# EasyEDA Pro project midi_footswitch.eprj

# Schematic midi
Board Name: midi; Create Date: 2025-01-20; Page Name: Sheet_1; Project Name: midi_footswitch; Schematic Name: midi; Update Date: 2025-01-20; Company: EasyEDA.com; Page Size: A4; Version: V1.0
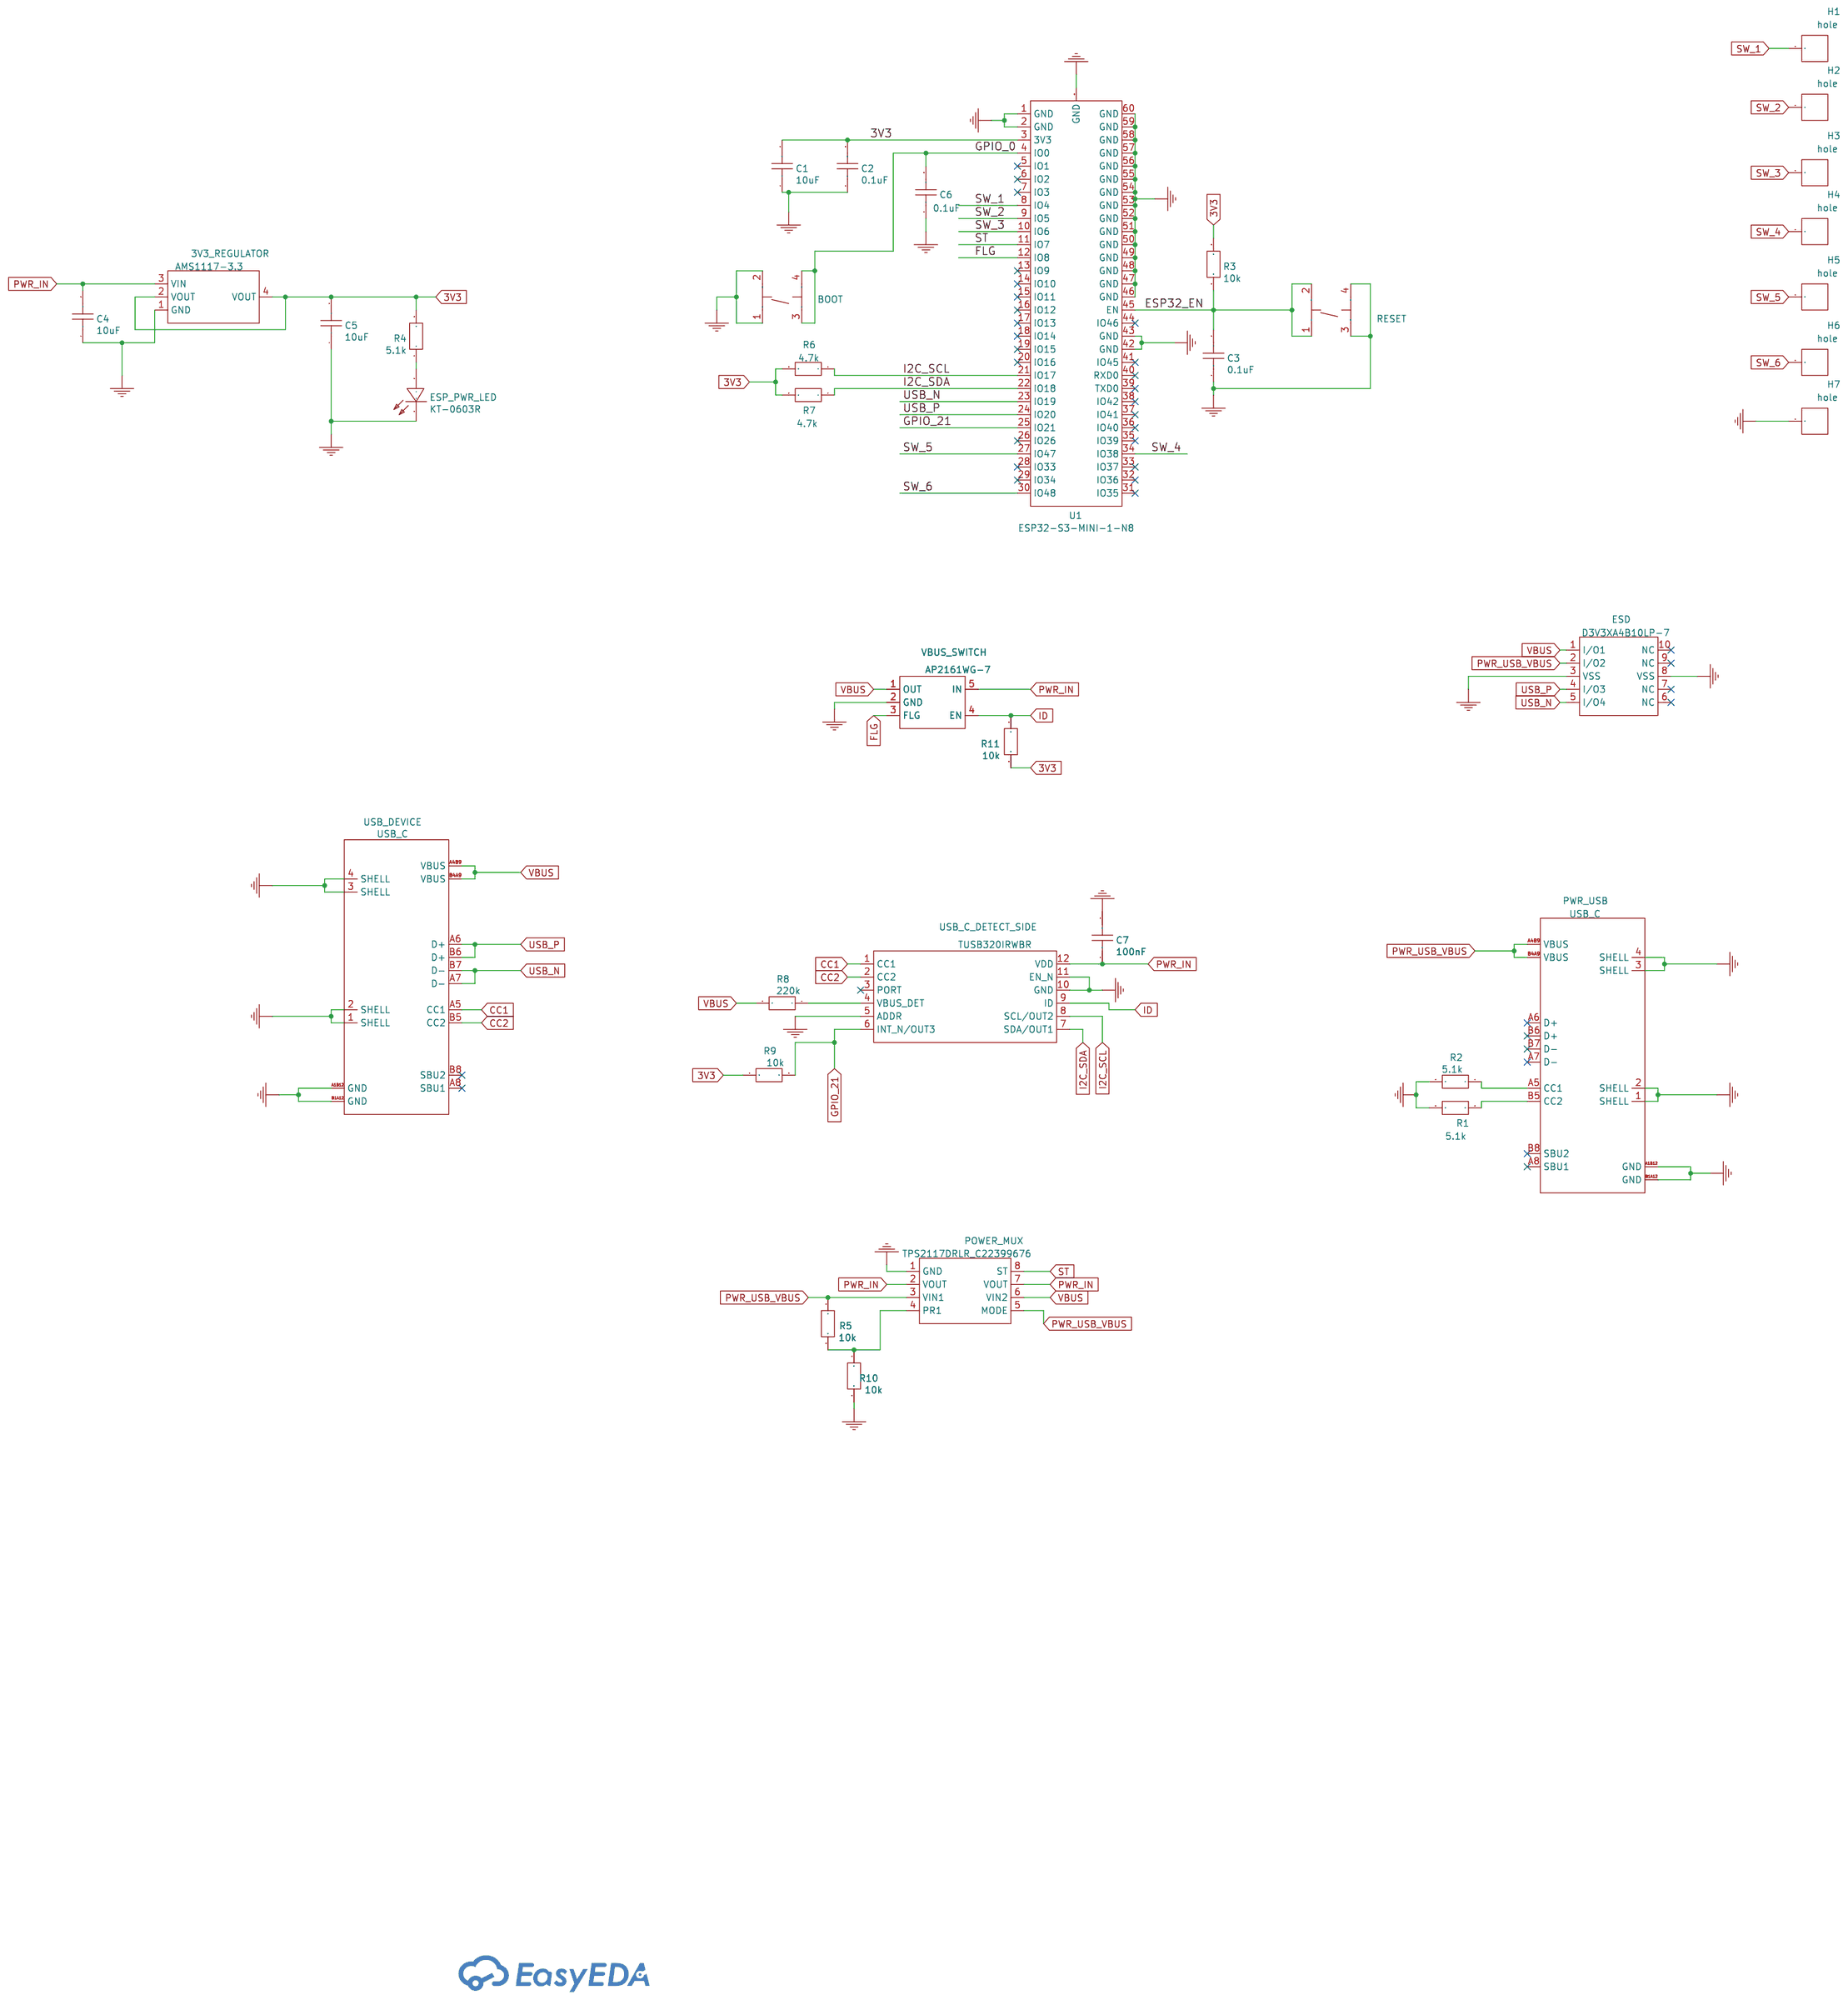
[diagram p0: schematic sheet]

## Parts
3V3_REGULATOR  AMS1117-3.3  [SOT-223-3_L6.5-W3.4-P2.30-LS7.0-BR]
BOOT  TS-1187A-B-A-B  [SW-SMD_4P-L5.1-W5.1-P3.70-LS6.5-TL_H1.5]
C1  10uF  [C0603]
C2  0.1uF  [C0603]
C3  0.1uF  [C0603]
C4  10uF  [C0603]
C5  10uF  [C0603]
C6  0.1uF  [C0603]
C7  100nF  [C0603]
ESD  D3V3XA4B10LP-7  [U-DFN2510-10_L2.5-W1.0-P0.50-BL]
ESP_PWR_LED  KT-0603R  [LED0603-RD]
H1  hole  [HOLE_FOOTPRITNG]
H2  hole  [HOLE_FOOTPRITNG]
H3  hole  [HOLE_FOOTPRITNG]
H4  hole  [HOLE_FOOTPRITNG]
H5  hole  [HOLE_FOOTPRITNG]
H6  hole  [HOLE_FOOTPRITNG]
H7  hole  [HOLE_FOOTPRITNG]
POWER_MUX  TPS2117DRLR_C22399676  [SOT-583-8_L2.1-W1.2-P0.50-LS1.6-BL]
PWR_USB  USB_C  [USB-C-SMD_G-SWITCH_GT-USB-7010EN]
R1  5.1k  [R0603]
R2  5.1k  [R0603]
R3  10k  [R0603]
R4  5.1k  [R0603]
R5  10k  [R0603]
R6  4.7k  [R0603]
R7  4.7k  [R0603]
R8  220k  [R0603]
R9  10k  [R0603]
R10  10k  [R0603]
R11  10k  [R0603]
RESET  TS-1187A-B-A-B  [SW-SMD_4P-L5.1-W5.1-P3.70-LS6.5-TL_H1.5]
U1  ESP32-S3-MINI-1-N8  [BULETM-SMD_ESP32-S3-MINI-1-N8]
USB_C_DETECT_SIDE  TUSB320IRWBR  [X2QFN-12_L1.6-W1.6-P0.40-TL]
USB_DEVICE  USB_C  [USB-C-SMD_G-SWITCH_GT-USB-7010EN]
VBUS_SWITCH  AP2161WG-7  [SOT-23-5_L2.9-W1.6-P0.95-LS2.8-BL]

## Library data of the parts
3V3_REGULATOR = AMS1117-3.3: Supplier: LCSC; Manufacturer: AMS; Supplier Part: C6186; JLCPCB Part Class: Basic Part
BOOT RESET = TS-1187A-B-A-B: Supplier: LCSC; Supplier Part: C318884; Manufacturer: XKB Connectivity(中国星坤); JLCPCB Part Class: Basic Part
C1 C4 C5 = 10uF
C2 C3 C6 = 0.1uF
C7 = 100nF
ESD = D3V3XA4B10LP-7: Supplier: LCSC; Supplier Part: C1980462; Manufacturer: DIODES(美台); JLCPCB Part Class: Extended Part
ESP_PWR_LED = KT-0603R: Supplier: LCSC; Manufacturer: KENTO; Supplier Part: C2286; JLCPCB Part Class: Basic Part; link: https://lcsc.com/eda_search?q=C2286&%26type=1&ref=editor
H1-H7 = hole
POWER_MUX = TPS2117DRLR_C22399676: Supplier: LCSC; Supplier Part: C22399676; Manufacturer: TI(德州仪器); Manufacturer Part: TPS2117DRLR; JLCPCB Part Class: Extended Part
PWR_USB USB_DEVICE = USB_C: Supplier: LCSC; Supplier Part: C2997433; Manufacturer: HCTL(华灿天禄); Manufacturer Part: HC-TYPE-C-16P-01A-R; JLCPCB Part Class: Extended Part
R1 R2 R4 = 5.1k
R3 R5 R9-R11 = 10k
R6 R7 = 4.7k
R8 = 220k
U1 = ESP32-S3-MINI-1-N8: Supplier: LCSC; Supplier Part: C2913206; Manufacturer: ESPRESSIF(乐鑫); JLCPCB Part Class: Extended Part
USB_C_DETECT_SIDE = TUSB320IRWBR: Supplier: LCSC; Supplier Part: C80170; Manufacturer: TI(德州仪器); JLCPCB Part Class: Extended Part
VBUS_SWITCH = AP2161WG-7: Supplier: LCSC; Supplier Part: C176957; Manufacturer: DIODES(美台); JLCPCB Part Class: Extended Part

## Nets
3V3: 3V3_REGULATOR.2(VOUT) 3V3_REGULATOR.4(VOUT) C1.2 C2.2 C5.2 R3.2 R4.2 R6.2 R7.2 R9.1 R11.2 U1.3(3V3)
GND: 3V3_REGULATOR.1(GND) BOOT.1(A) BOOT.2(B) C1.1 C2.1 C3.1 C4.1 C5.1 C6.1 C7.2 ESD.3(VSS) ESD.8(VSS) ESP_PWR_LED.1(K) H7.1 POWER_MUX.1(GND) PWR_USB.1(SHELL) PWR_USB.2(SHELL) PWR_USB.3(SHELL) PWR_USB.4(SHELL) PWR_USB.A1B12(GND) PWR_USB.B1A12(GND) R1.2 R2.2 R10.2 RESET.3(C) RESET.4(D) U1.1(GND) U1.2(GND) U1.42(GND) U1.43(GND) U1.46(GND) U1.47(GND) U1.48(GND) U1.49(GND) U1.50(GND) U1.51(GND) U1.52(GND) U1.53(GND) U1.54(GND) U1.55(GND) U1.56(GND) U1.57(GND) U1.58(GND) U1.59(GND) U1.60(GND) U1.GND USB_C_DETECT_SIDE.5(ADDR) USB_C_DETECT_SIDE.10(GND) USB_C_DETECT_SIDE.11(EN_N) USB_DEVICE.1(SHELL) USB_DEVICE.2(SHELL) USB_DEVICE.3(SHELL) USB_DEVICE.4(SHELL) USB_DEVICE.A1B12(GND) USB_DEVICE.B1A12(GND) VBUS_SWITCH.2(GND)
VBUS: ESD.1(I/O1) POWER_MUX.6(VIN2) R8.2 USB_DEVICE.A4B9(VBUS) USB_DEVICE.B4A9(VBUS) VBUS_SWITCH.1(OUT)
CC1: USB_C_DETECT_SIDE.1(CC1) USB_DEVICE.A5(CC1)
CC2: USB_C_DETECT_SIDE.2(CC2) USB_DEVICE.B5(CC2)
ESP32_EN: C3.2 R3.1 RESET.1(A) RESET.2(B) U1.45(EN)
FLG: U1.12(IO8) VBUS_SWITCH.3(FLG)
GPIO_0: BOOT.3(C) BOOT.4(D) C6.2 U1.4(IO0)
GPIO_21: R9.2 U1.25(IO21) USB_C_DETECT_SIDE.6(INT_N/OUT3)
I2C_SCL: R6.1 U1.21(IO17) USB_C_DETECT_SIDE.8(SCL/OUT2)
I2C_SDA: R7.1 U1.22(IO18) USB_C_DETECT_SIDE.7(SDA/OUT1)
ID: R11.1 USB_C_DETECT_SIDE.9(ID) VBUS_SWITCH.4(EN)
PWR_IN: 3V3_REGULATOR.3(VIN) C4.2 C7.1 POWER_MUX.2(VOUT) POWER_MUX.7(VOUT) USB_C_DETECT_SIDE.12(VDD) VBUS_SWITCH.5(IN)
PWR_USB_VBUS: ESD.2(I/O2) POWER_MUX.3(VIN1) POWER_MUX.5(MODE) PWR_USB.A4B9(VBUS) PWR_USB.B4A9(VBUS) R5.1
ST: POWER_MUX.8(ST) U1.11(IO7)
SW_1: H1.1 U1.8(IO4)
SW_2: H2.1 U1.9(IO5)
SW_3: H3.1 U1.10(IO6)
SW_4: H4.1 U1.34(IO38)
SW_5: H5.1 U1.27(IO47)
SW_6: H6.1 U1.30(IO48)
USB_N: ESD.5(I/O4) U1.23(IO19) USB_DEVICE.A7(D-) USB_DEVICE.B7(D-)
USB_P: ESD.4(I/O3) U1.24(IO20) USB_DEVICE.A6(D+) USB_DEVICE.B6(D+)
POWER_MUX_4: POWER_MUX.4(PR1) R5.2 R10.1
PWR_USB_A5: PWR_USB.A5(CC1) R2.1
PWR_USB_B5: PWR_USB.B5(CC2) R1.1
R4_1: ESP_PWR_LED.2(A) R4.1
USB_C_DETECT_SIDE_4: R8.1 USB_C_DETECT_SIDE.4(VBUS_DET)

Not connected (* = marked no-connect by the designer): ESD 6(NC)* 7(NC)* 9(NC)* 10(NC)*; PWR_USB A6(D+)* A7(D-)* A8(SBU1)* B6(D+)* B7(D-)* B8(SBU2)*; U1 5(IO1)* 6(IO2)* 7(IO3)* 13(IO9)* 14(IO10)* 15(IO11)* 16(IO12)* 17(IO13)* 18(IO14)* 19(IO15)* 20(IO16)* 26(IO26)* 28(IO33)* 29(IO34)* 31(IO35)* 32(IO36)* 33(IO37)* 35(IO39)* 36(IO40)* 37(IO41)* 38(IO42)* 39(TXD0)* 40(RXD0)* 41(IO45)* 44(IO46)*; USB_C_DETECT_SIDE 3(PORT)*; USB_DEVICE A8(SBU1)* B8(SBU2)*

# Board PCB_PCB_midi_2025-01-20
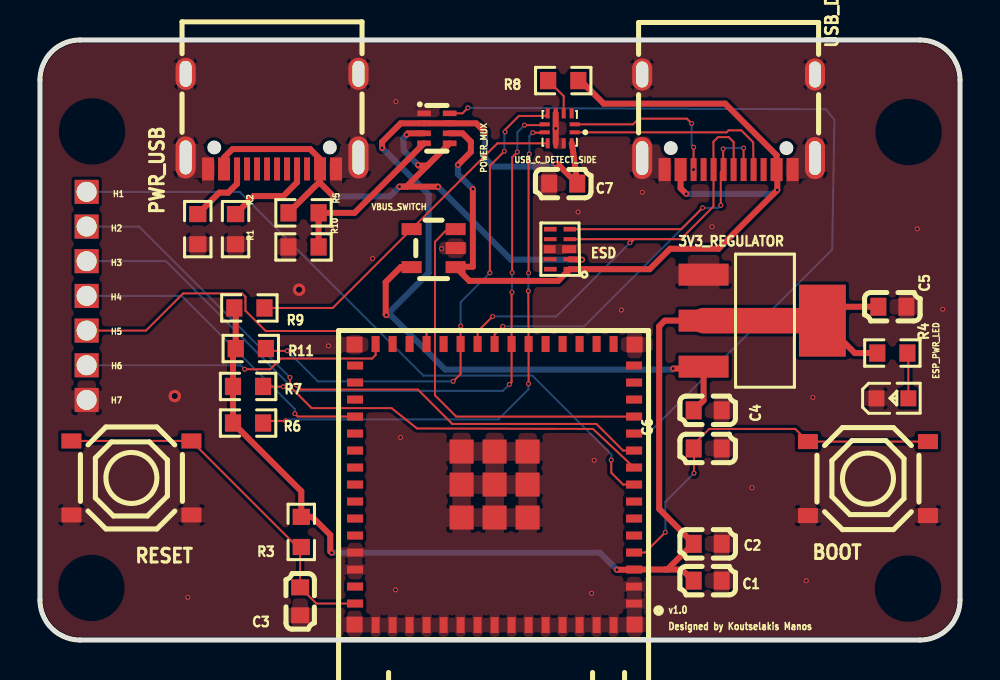
[diagram p1: board, top side]
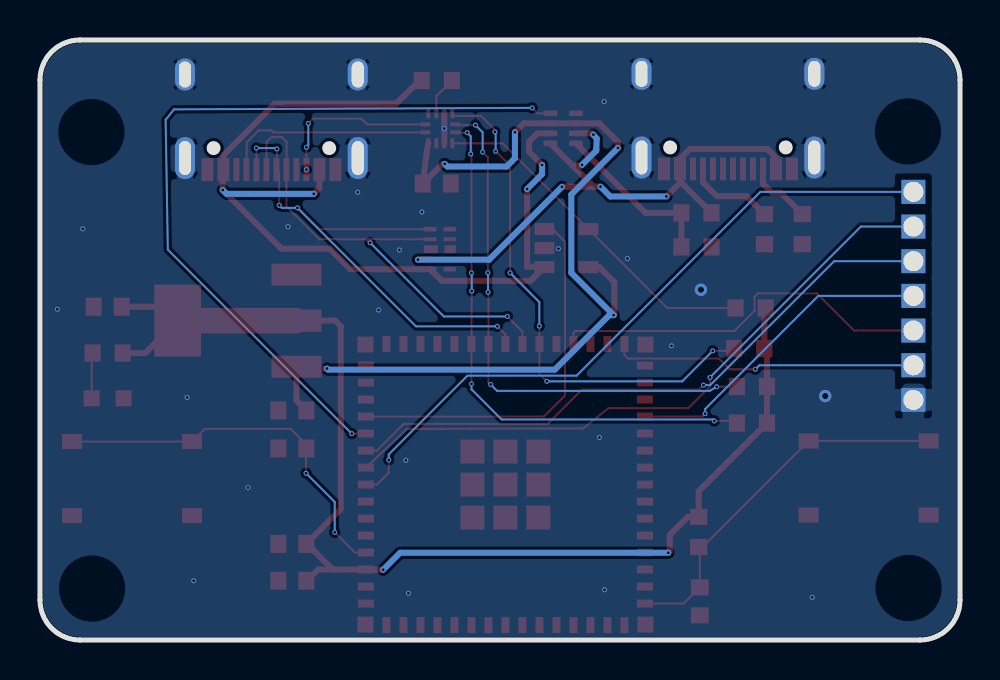
[diagram p2: board, bottom side, seen from below]

Outline 46 x 30 mm; copper layers: Top Layer, Bottom Layer. Coordinates in mm from the lower left corner of the outline.
Outline path: 0,28 arc(0.59,29.41) 2,30 44,30 arc(45.41,29.41) 46,28 46,2 arc(45.41,0.59) 44,0 2,0 arc(0.59,0.59) 0,2 0,28
Stack: Top Layer 0.035mm / Dielectric1 1.51mm FR4 er 4.5 / Bottom Layer 0.035mm

## Design rules (mm)
spacing Default (default): track to track 0.1, other pairs 0 to 0.1
spacing PWR: track to track 0.1, other pairs 0 to 0.1
track width Default (default): min 0.1, default 0.1, max 25.4
track width PWR: min 0.3, default 0.3, max 25.4
differential pair differentialPair (default): width min 0.127, default 0.254, max 2.54; gap min 0.152, default 0.152
via Default (default): diameter min 0.25, default 0.25, max 100.025; hole min 0.15, default 0.15, max 59.995
via PWR: diameter min 0.25, default 0.25, max 100.025; hole min 0.15, default 0.15, max 59.995
net VBUS uses PWR
net 3V3 uses PWR
net PWR_USB_VBUS uses PWR
net PWR_IN uses PWR
net GND uses PWR
net POWER_MUX_4 uses PWR
net PWR_USB_B5 uses PWR
net PWR_USB_A5 uses PWR
pour e228 uses gge60520
pour e313 uses gge60148

## Placement (name value [footprint] x y rotation side)
3V3_REGULATOR  AMS1117-3.3  [SOT-223-3_L6.5-W3.4-P2.30-LS7.0-BR]  36.15 15.97 180 top
BOOT  TS-1187A-B-A-B  [SW-SMD_4P-L5.1-W5.1-P3.70-LS6.5-TL_H1.5]  41.4 8.07 180 top
C1  10uF  [C0603]  33.38 2.97 180 top
C2  0.1uF  [C0603]  33.38 4.81 180 top
C3  0.1uF  [C0603]  13.01 1.93 90 top
C4  10uF  [C0603]  33.38 11.48 180 top
C5  10uF  [C0603]  42.62 16.66 180 top
C6  0.1uF  [C0603]  33.38 9.58 180 top
C7  100nF  [C0603]  26.16 22.82 180 top
ESD  D3V3XA4B10LP-7  [U-DFN2510-10_L2.5-W1.0-P0.50-BL]  25.99 19.54 90 top
ESP_PWR_LED  KT-0603R  [LED0603-RD]  42.62 12.08 0 top
H1  hole  [HOLE_FOOTPRITNG]  2.33 22.41 0 top
H2  hole  [HOLE_FOOTPRITNG]  2.33 20.67 0 top
H3  hole  [HOLE_FOOTPRITNG]  2.33 18.94 0 top
H4  hole  [HOLE_FOOTPRITNG]  2.33 17.21 0 top
H5  hole  [HOLE_FOOTPRITNG]  2.33 15.47 0 top
H6  hole  [HOLE_FOOTPRITNG]  2.33 13.74 0 top
H7  hole  [HOLE_FOOTPRITNG]  2.33 12 0 top
POWER_MUX  TPS2117DRLR_C22399676  [SOT-583-8_L2.1-W1.2-P0.50-LS1.6-BL]  19.84 25.58 270 top
PWR_USB  USB_C  [USB-C-SMD_G-SWITCH_GT-USB-7010EN]  11.6 25.93 180 top
R1  5.1k  [R0603]  7.89 20.54 270 top
R2  5.1k  [R0603]  9.78 20.54 270 top
R3  10k  [R0603]  13.06 5.4 90 top
R4  5.1k  [R0603]  42.62 14.35 180 top
R5  10k  [R0603]  13.18 21.36 0 top
R6  4.7k  [R0603]  10.4 10.85 180 top
R7  4.7k  [R0603]  10.4 12.68 180 top
R8  220k  [R0603]  26.16 27.97 0 top
R9  10k  [R0603]  10.54 14.57 0 top
R10  10k  [R0603]  13.18 19.65 180 top
R11  10k  [R0603]  10.47 16.6 180 top
RESET  TS-1187A-B-A-B  [SW-SMD_4P-L5.1-W5.1-P3.70-LS6.5-TL_H1.5]  4.57 8.1 0 top
U1  ESP32-S3-MINI-1-N8  [BULETM-SMD_ESP32-S3-MINI-1-N8]  22.73 7.77 180 top
USB_C_DETECT_SIDE  TUSB320IRWBR  [X2QFN-12_L1.6-W1.6-P0.40-TL]  25.98 25.58 180 top
USB_DEVICE  USB_C  [USB-C-SMD_G-SWITCH_GT-USB-7010EN]  34.43 25.9 180 top
VBUS_SWITCH  AP2161WG-7  [SOT-23-5_L2.9-W1.6-P0.95-LS2.8-BL]  19.68 19.59 90 top

## Footprints (pads in the part's own frame, mm; a bottom-side part is the same pattern mirrored in y, then rotated)
BULETM-SMD_ESP32-S3-MINI-1-N8
  rect 0.8x0.4 smd: 1(-6.975,5.95) 2(-6.975,5.1) 3(-6.975,4.25) 4(-6.975,3.4) 5(-6.975,2.55) 6(-6.975,1.7) 7(-6.975,0.85) 8(-6.975,0.001) 9(-6.975,-0.85) 10(-6.975,-1.7) 11(-6.975,-2.55) 12(-6.975,-3.4) 13(-6.975,-4.25) 14(-6.975,-5.1) 15(-6.975,-5.95) 31(6.975,-5.95) 32(6.975,-5.1) 33(6.975,-4.25) 34(6.975,-3.4) 35(6.975,-2.55) 36(6.975,-1.7) 37(6.975,-0.85) 38(6.975,0.001) 39(6.975,0.85) 40(6.975,1.7) 41(6.975,2.55) 42(6.975,3.4) 43(6.975,4.25) 44(6.975,5.1) 45(6.975,5.95)
  rect 0.4x0.8 smd: 16(-5.95,-7.025) 17(-5.1,-7.025) 18(-4.25,-7.025) 19(-3.4,-7.025) 20(-2.55,-7.025) 21(-1.7,-7.025) 22(-0.85,-7.025) 23(0,-7.025) 24(0.85,-7.025) 25(1.7,-7.025) 26(2.55,-7.025) 27(3.4,-7.025) 28(4.25,-7.025) 29(5.1,-7.025) 30(5.95,-7.025) 46(5.95,7.025) 47(5.1,7.025) 48(4.25,7.025) 49(3.4,7.025) 50(2.55,7.025) 51(1.7,7.025) 52(0.85,7.025) 53(0,7.025) 54(-0.85,7.025) 55(-1.7,7.025) 56(-2.55,7.025) 57(-3.4,7.025) 58(-4.25,7.025) 59(-5.1,7.025) 60(-5.95,7.025)
  rect 0.8x0.8 smd: GND(-7,7) GND(-7,-7) GND(7,7) GND(7,-7)
  rect 1.2x1.2 smd: GND(-1.65,1.65) GND(-1.65,0.001) GND(-1.65,-1.65) GND(0,1.65) GND(0,0.001) GND(0,-1.65) GND(1.65,1.65) GND(1.65,0.001) GND(1.65,-1.65)
C0603
  rect 0.8x0.9 smd: 1(-0.7,0) 2(0.7,0)
HOLE_FOOTPRITNG
  rect 1.2x1.2 hole 1: 1(0,0)
LED0603-RD
  rect 0.8x0.8 smd: 1(-0.799,0) 2(0.799,0)
R0603
  rect 0.806x0.864 smd: 1(-0.753,0) 2(0.753,0)
SOT-23-5_L2.9-W1.6-P0.95-LS2.8-BL
  rect 0.6x1 smd: 1(-0.95,-1.1) 2(0,-1.1) 3(0.95,-1.1) 4(0.95,1.1) 5(-0.95,1.1)
SOT-223-3_L6.5-W3.4-P2.30-LS7.0-BR
  rect 2.5x1.1 smd: 1(2.97,-2.3) 2(2.97,0) 3(2.97,2.3)
  rect 2.34x3.6 smd: 4(-2.97,0)
SOT-583-8_L2.1-W1.2-P0.50-LS1.6-BL
  rect 0.28x0.68 smd: 1(-0.75,-0.64) 2(-0.25,-0.64) 3(0.25,-0.64) 4(0.75,-0.64) 5(0.75,0.64) 6(0.25,0.64) 7(-0.25,0.64) 8(-0.75,0.64)
SW-SMD_4P-L5.1-W5.1-P3.70-LS6.5-TL_H1.5
  rect 1x0.75 smd: 1(-3,1.85) 2(3,1.85) 3(-3,-1.85) 4(3,-1.85)
U-DFN2510-10_L2.5-W1.0-P0.50-BL
  rect 0.23x0.625 smd: 1(-1,-0.5) 5(1,-0.5) 6(1,0.475) 10(-1,0.475)
  rect 0.2x0.625 smd: 2(-0.5,-0.5) 4(0.5,-0.5) 7(0.5,0.475) 9(-0.5,0.475)
  rect 0.4x0.7 smd: 3(0,-0.465)
  rect 0.4x0.575 smd: 8(0,0.5)
USB-C-SMD_G-SWITCH_GT-USB-7010EN
  oval 1x2.1 hole 0.6x1.7: 1(-4.32,1.802) 2(4.32,1.802)
  oval 1x1.6 hole 0.6x1.3: 3(4.32,-2.377) 4(-4.32,-2.377)
  rect 0.6x1.15 smd: A1B12(-3.2,2.377) A4B9(-2.4,2.377) B1A12(3.2,2.377) B4A9(2.4,2.377)
  rect 0.3x1.15 smd: A5(-1.25,2.377) A6(-0.25,2.377) A7(0.25,2.377) A8(1.25,2.377) B5(1.75,2.377) B6(0.75,2.377) B7(-0.75,2.377) B8(-1.75,2.377)
X2QFN-12_L1.6-W1.6-P0.40-TL
  rect 0.505x0.2 smd: 1(-0.75,0.2) 2(-0.75,-0.2) 7(0.75,-0.2) 8(0.75,0.2)
  rect 0.2x0.505 smd: 3(-0.6,-0.75) 4(-0.2,-0.75) 5(0.2,-0.75) 6(0.6,-0.75) 9(0.6,0.75) 10(0.2,0.75) 11(-0.2,0.75) 12(-0.6,0.75)

## Nets
As in the schematic.

Pads without a net: ESD 6 7 9 10; PWR_USB A6 A7 A8 B6 B7 B8; U1 5 6 7 13 14 15 16 17 18 19 20 26 28 29 31 32 33 35 36 37 38 39 40 41 44; USB_C_DETECT_SIDE 3; USB_DEVICE A8 B8

## Via types
v1: diameter 0.25, hole 0.15, Top Layer to Bottom Layer, 74 vias
v2: diameter 0.62, hole 0.31, Top Layer to Bottom Layer, 2 vias

## Routing (per net, layer and track width the routed paths; a pad name or vN(x,y) marks a point on that pad's centre or on a via; arc(x,y) is an arc through that point)
3V3: length 61.7
  Top Layer w0.3: v1(28.84,3.51) 29.7,3.51 U1.3 32.09,3.52 32.65,2.97 ; 41.87,14.35 40.74,14.35 39.12,15.97 39.81,16.66 C5.2 ; 3V3_REGULATOR.2 31.24,15.97 30.96,15.69 30.96,6.55 C2.2 ; v1(14.58,4.36) 14.51,4.43 14.51,5.25 13.61,6.16 R3.2 13.06,7.43 R6.2 R7.2 9.65,14.44 R9.1 9.79,16.53 R11.2 ; 31.21,3.52 31.36,3.52 32.65,4.81
  Top Layer w1.274: 3V3_REGULATOR.2 39.12,15.97
  Bottom Layer w0.3: v1(28.84,3.51) 27.99,4.36 v1(14.58,4.36)
GND: length 1.5
  Top Layer w0.3: 25.79,24.83 v1(25.79,25.58) 25.79,26.33
  vias: v1(7.39,2.13) v1(14.42,14.71) v1(16.63,19.07) v1(17.79,26.92) v1(17.77,2.51) v1(18.03,10.13) v1(20.08,19.57) v1(26.9,21.4) v1(27.58,2.33) v1(27.71,8.98) v1(28.03,19.5) v1(29.07,16.5) v1(30.11,22.39) v1(33.6,20.66) v1(35.6,7.62) v1(38.31,2.96) v1(38.64,12.13) v1(43.86,20.56) v1(45.13,16.54) v2(6.74,12.2) v2(12.95,17.51)
VBUS: length 46.4
  Top Layer w0.3: v1(21.64,22.55) 21.64,18.66 20.8,18.66 20.78,18.64 21.47,17.96 25.91,17.96 ESD.1 30.48,18.54 31.5,19.56 33.93,19.56 v1(36.86,22.5) 36.86,23.49 USB_DEVICE.A4B9 36.83,24.24 34.26,26.82 28.18,26.82 27.03,27.97 26.91,27.97 ; POWER_MUX.6 21.13,25.33 21.54,24.92 21.54,24.4 v1(20.89,23.75) ; USB_DEVICE.B4A9 32.03,22.59 v1(32.31,22.31)
  Bottom Layer w0.3: v1(36.86,22.5) 36.67,22.31 v1(32.31,22.31) ; v1(20.89,23.75) 20.89,23.3 v1(21.64,22.55)
CC1: length 10.6
  Top Layer w0.1: 26.74,25.38 34.33,25.38 34.43,25.48 35.06,25.48 35.66,24.89 USB_DEVICE.A5
CC2: length 8.4
  Top Layer w0.1: 26.73,25.78 29.65,25.78 29.94,26.07 32.34,26.07 v1(32.58,25.83) ; v1(32.68,23.52) v1(32.68,24.64)
  Bottom Layer w0.1: v1(32.68,24.64) 32.58,24.73 v1(32.58,25.83)
ESP32_EN: length 18.8
  Top Layer w0.1: U1.45 13.82,1.82 C3.2 13.01,4.59 R3.1 12.87,4.65 RESET.2 RESET.1
FLG: length 19.4
  Top Layer w0.1: 29.71,11.17 20.81,11.17 19.75,12.23 19.75,19.91 20.26,20.44 20.67,20.44 20.78,20.54
GPIO_0: length 19.3
  Top Layer w0.1: v1(31.26,5.38) 30.25,4.37 U1.4 ; 44.4,9.92 38.4,9.92 37.77,10.55 33.46,10.55 32.68,9.78 C6.2 32.7,9.56 v1(32.7,8.34)
  Bottom Layer w0.1: v1(31.26,5.38) 31.26,6.9 v1(32.7,8.34)
GPIO_21: length 26.2
  Top Layer w0.1: v1(20.66,12.93) 21.03,13.3 U1.25 ; 25.39,26.33 25.26,26.2 23.94,26.2 23.25,25.51 v1(23.25,25.41) ; v1(12.36,14.46) 11.41,14.46 R9.2 ; v1(21.03,15.69) 21.03,14.8 ; v1(23.22,24.44) 22.49,23.71 v1(22.49,18.36)
  Bottom Layer w0.1: v1(12.36,14.46) 13.89,12.93 v1(20.66,12.93) ; v1(22.49,18.36) 21.03,16.9 v1(21.03,15.69) ; v1(23.25,25.41) 23.22,25.37 v1(23.22,24.44)
I2C_SCL: length 27.5
  Top Layer w0.1: v1(24.42,12.81) 24.43,12.81 U1.21 24.41,17.45 ; v1(24.43,18.35) 24.43,24.26 v1(24.46,24.3) ; R6.1 11.26,10.95 v1(12.28,10.95) ; 25.24,25.38 25.22,25.37 v1(24.64,25.37)
  Bottom Layer w0.1: v1(24.43,18.35) 24.41,18.34 v1(24.41,17.45) ; v1(24.46,24.3) 24.46,25.19 v1(24.64,25.37) ; v1(24.42,12.81) 24.42,12.53 22.92,11.03 12.36,11.03 v1(12.28,10.95)
I2C_SDA: length 26.8
  Top Layer w0.1: v1(23.61,18.37) 23.61,24.14 v1(23.87,24.4) ; v1(23.6,17.39) 23.58,17.37 U1.22 23.58,12.89 v1(23.47,12.78) ; 25.24,25.78 25.2,25.74 v1(24.22,25.74) ; v1(12.16,12.66) 11.17,12.66 11.16,12.68
  Bottom Layer w0.1: v1(23.61,18.37) 23.6,18.36 v1(23.6,17.39) ; v1(23.47,12.78) 23.15,12.46 12.51,12.46 12.16,12.66 ; v1(23.87,24.4) 23.87,25.39 v1(24.22,25.74)
ID: length 17.6
  Top Layer w0.1: R11.1 14.64,16.6 VBUS_SWITCH.4 22.87,24.83 25.39,24.83
POWER_MUX_4: length 8.4
  Top Layer w0.3: R10.1 R5.2 15.73,21.36 POWER_MUX.4
PWR_IN: length 47.5
  Top Layer w0.3: v1(31.65,13.57) 33.08,13.57 3V3_REGULATOR.3 33.18,11.98 C4.2 ; C7.1 25.87,23.81 v1(25.76,23.81) ; 26.59,24.83 26.65,24.49 26.86,22.82 ; v1(17.32,16.24) 17.28,16.28 17.28,17.89 18.04,18.64 VBUS_SWITCH.5 ; 19.2,25.83 18.03,25.83 17.1,24.9 v1(17.1,24.6) ; POWER_MUX.2 POWER_MUX.7 21.81,25.83 v1(22.25,25.39)
  Bottom Layer w0.3: v1(17.1,24.6) 19.43,22.27 19.43,18.36 v1(17.32,16.24) 17.53,16.24 20.26,13.52 31.6,13.52 v1(31.65,13.57) ; v1(25.76,23.81) 25.63,23.67 22.67,23.67 22.25,24.09 v1(22.25,25.39)
PWR_USB_A5: length 4.4
  Top Layer w0.3: PWR_USB.A5 12.85,22.88 12.17,22.2 10.68,22.2 R2.1
PWR_USB_B5: length 3.3
  Top Layer w0.3: R1.1 8.96,22.37 9.41,22.37 9.85,22.81 PWR_USB.B5
PWR_USB_VBUS: length 32.2
  Top Layer w0.3: PWR_USB.A4B9 14,22.86 v1(14.68,22.18) ; PWR_USB.A4B9 14,24.05 13.5,24.55 9.63,24.55 9.2,24.12 PWR_USB.B4A9 ; PWR_USB.A4B9 14,22.94 R5.1 ; v1(18.9,23.76) 18.94,23.72 19.37,23.72 ; v1(17.97,22.67) 18.32,22.67 POWER_MUX.5 ; v1(27.1,19.02) ESD.2 ; v1(19.9,22.66) 19.9,22.67 17.97,22.67 ; POWER_MUX.3 18.39,25.33 v1(18.33,25.27)
  Bottom Layer w0.3: v1(19.9,22.66) 23.54,19.02 v1(27.1,19.02) ; 18.34,25.27 18.16,25.07 18.19,24.54 18.19,24.47 v1(18.9,23.76) ; v1(17.97,22.67) 17.48,22.18 v1(14.68,22.18)
R4_1: length 2.3
  Top Layer w0.1: R4.1 43.42,14.3 43.42,12.08
ST: length 39.8
  Top Layer w0.1: U1.11 29.71,10.32 v1(30.41,10.32) ; v1(21.39,26.61) 21.12,26.33 POWER_MUX.8
  Bottom Layer w0.1: v1(30.41,10.32) 39.61,19.52 39.72,26.01 39.3,26.53 v1(21.39,26.61)
SW_1: length 34
  Top Layer w0.1: v1(28.56,9) 28.56,8.36 29.15,7.77 U1.8
  Bottom Layer w0.1: H1.1 9.98,22.41 19.17,13.22 24.63,13.22 28.56,9.28 v1(28.56,9)
SW_2: length 32.5
  Top Layer w0.1: 12.5,13.13 12.5,12.68 13.58,11.59 17.58,11.59 18.85,10.58 27.65,10.55 29.71,8.62
  Bottom Layer w0.1: H2.1 4.95,20.67 v1(12.5,13.13)
SW_3: length 31.3
  Top Layer w0.1: U1.10 29.15,9.47 ; 29.15,9.47 27.82,10.8 20.61,10.8 18.9,12.52 13.05,12.52 12.82,12.74
  Bottom Layer w0.1: v1(12.82,12.74) 12.49,12.74 6.29,18.94 2.33,18.94
SW_4: length 16.1
  Top Layer w0.1: v1(12.74,11.32) 12.89,11.17 U1.34
  Bottom Layer w0.1: H4.1 7.08,17.21 12.74,11.55 v1(12.74,11.32)
SW_5: length 19.6
  Top Layer w0.1: U1.27 19.33,15.35 19.23,15.45 11.28,15.45 10.27,16.46 10.27,17.16 10.1,17.33 7.16,17.33 5.3,15.47 H5.1
SW_6: length 15.4
  Top Layer w0.1: U1.30 16.78,14.25 16.61,14.07 12.05,14.07 11.51,13.54 v1(10.23,13.54)
  Bottom Layer w0.1: H6.1 10.03,13.74 v1(10.23,13.54)
USB_C_DETECT_SIDE_4: length 2
  Top Layer w0.1: USB_C_DETECT_SIDE.4 26.18,27.19 R8.1
USB_N: length 26.5
  Top Layer w0.1: U1.23 22.73,15.28 v1(23.13,15.68) ; v1(34.16,24.55) 34.16,23.54 USB_DEVICE.A7 34.04,23.38 v1(34.04,21.73) ; ESD.5 32.06,20.54 v1(33.13,21.61) ; v1(35.18,24.6) USB_DEVICE.B7
  Bottom Layer w0.1: v1(34.04,21.73) 33.91,21.61 v1(33.13,21.61) 27.2,15.68 v1(23.13,15.68) ; v1(35.18,24.6) 34.2,24.6 v1(34.16,24.55)
USB_P: length 24
  Top Layer w0.1: USB_DEVICE.A6 34.68,24.9 34.43,25.14 33.9,25.14 33.67,24.91 USB_DEVICE.B6 33.67,21.68 32.04,20.04 ESD.4 ; v1(22.63,16.18) 21.88,15.42 U1.24 ; v1(29.49,19.86) 29.53,19.86 29.71,20.04
  Bottom Layer w0.1: v1(29.49,19.86) 25.81,16.18 v1(22.63,16.18)

## Copper pours and planes (outline as drawn; the poured copper is in the pictures)
GND on Top Layer: -11.32,37.88 54.43,37.88 64.59,27.72 64.59,-10.86 57.35,-18.1 -3.14,-18.1 -10.76,-10.48
GND on Bottom Layer: -9.17,-9.94 52.86,-9.94 57.61,-5.2 57.61,37.85 53.4,42.06 -0.27,42.06 -5.76,36.58

## Text on the board
Top Silkscreen Layer: v1.0 | Designed by Koutselakis Manos
